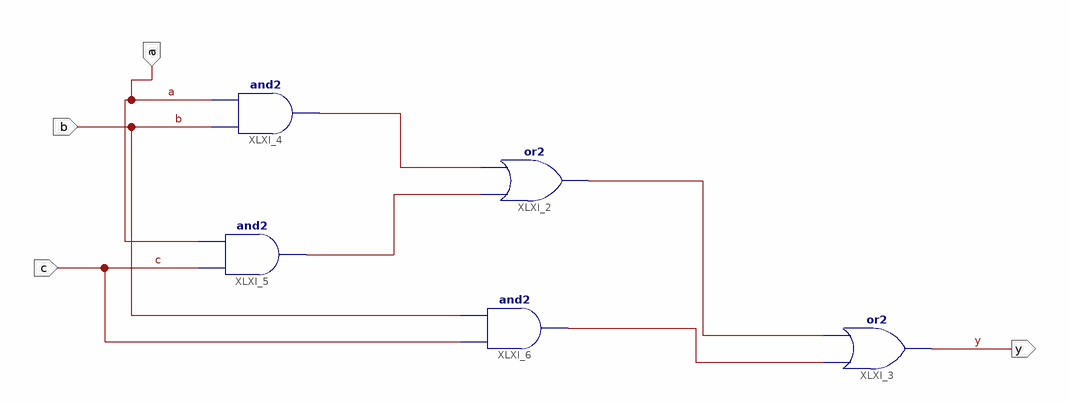
[diagram p0: schematic sheet 1]
// Xilinx ISE schematic schematic.sch (spartan3e) as structural Verilog: 5 symbols, 4 ports
module schematic (
  input  a,
  input  b,
  input  c,
  output y
);

  wire XLXN_3, XLXN_4, XLXN_8, XLXN_9;

  or XLXI_2 (XLXN_8, XLXN_4, XLXN_3);
  or XLXI_3 (y, XLXN_9, XLXN_8);
  and XLXI_4 (XLXN_3, b, a);
  and XLXI_5 (XLXN_4, c, a);
  and XLXI_6 (XLXN_9, c, b);
endmodule
